# Altium schematic sheet DVT-Discrete-2.SchDoc
size A4
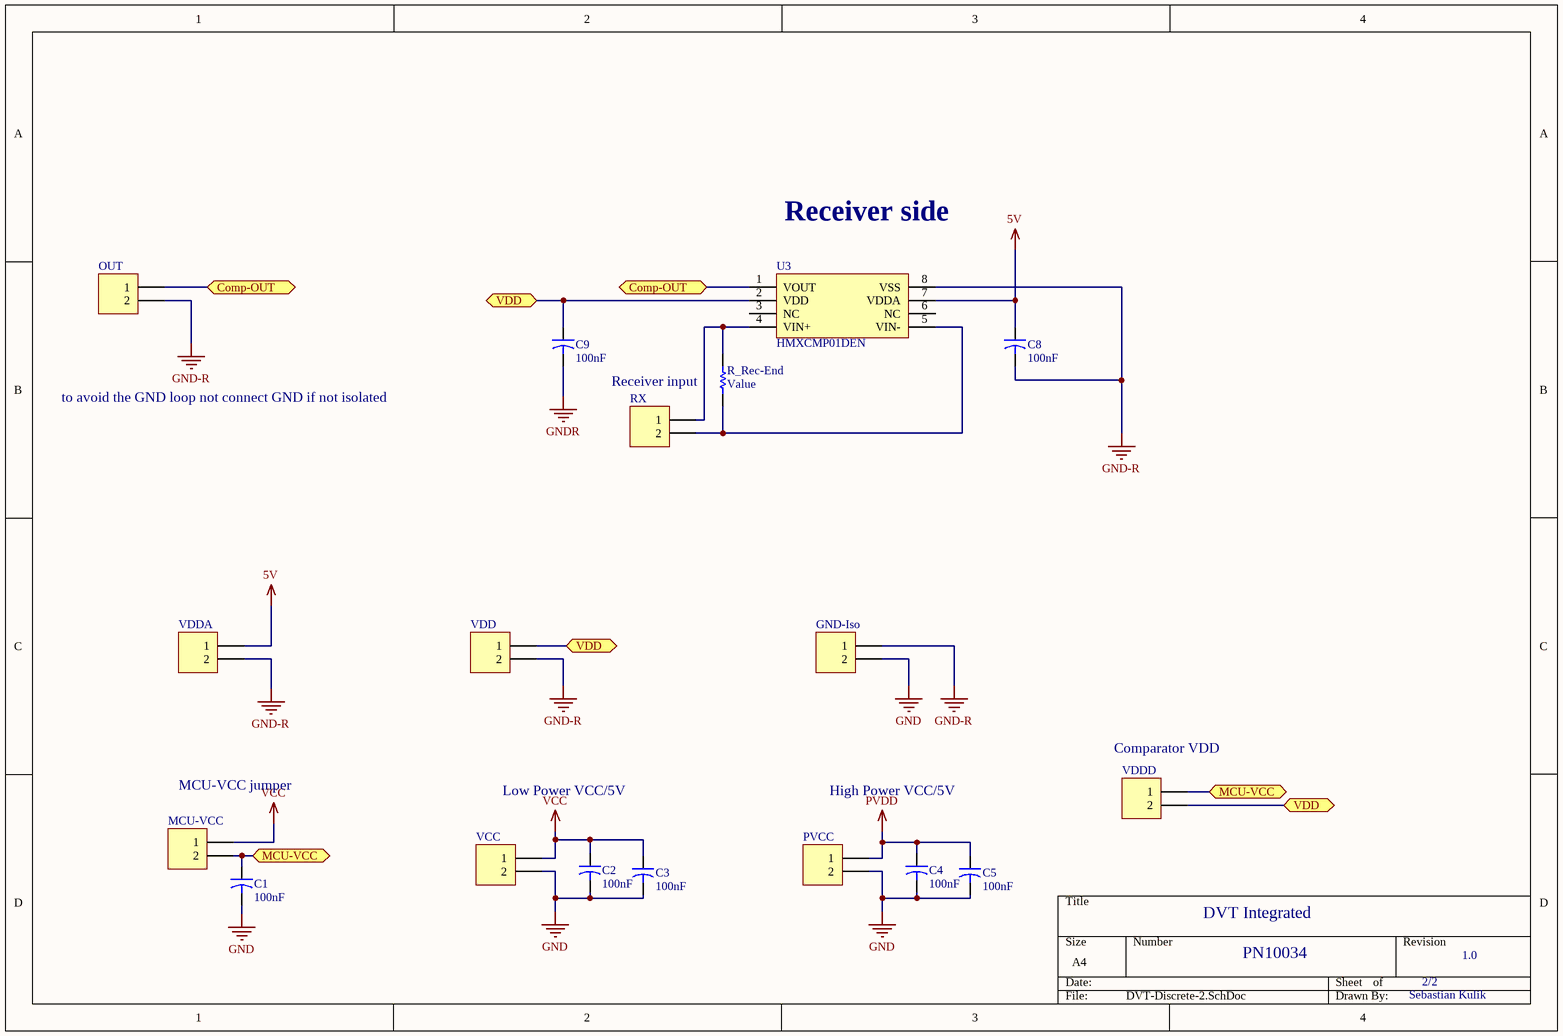
[diagram p0: DVT-Discrete-2.SchDoc]

## Parts
C1  value 100nF  [Dummy-10mm]  (hidden comment: Capacitor-Dummy-THT)
C2  value 100nF  [Dummy-10mm]  (hidden comment: Capacitor-Dummy-THT)
C3  value 100nF  [Dummy-10mm]  (hidden comment: Capacitor-Dummy-THT)
C4  value 100nF  [Dummy-10mm]  (hidden comment: Capacitor-Dummy-THT)
C5  value 100nF  [Dummy-10mm]  (hidden comment: Capacitor-Dummy-THT)
C8  value 100nF  [Dummy-10mm]  (hidden comment: Capacitor-Dummy-THT)
C9  value 100nF  [Dummy-10mm]  (hidden comment: Capacitor-Dummy-THT)
GND-Iso  PHOENIX_1715721  [Phoenix-2-5_08]  (value not drawn)
MCU-VCC  Plug_2_90_2.54  [HDR1X2]  (value not drawn)
OUT  Plug_2_90_2.54  [HDR1X2]  (value not drawn)
PVCC  PHOENIX_1715721  [Phoenix-2-5_08]  (value not drawn)
R_Rec-End  Resistor-Dummy-THT  [Dummy-10mm]  (value not drawn)
RX  PHOENIX_1715721  [Phoenix-2-5_08]  (value not drawn)
U3  HMXCMP01DEN  [Honeywell-SO8]
VCC  PHOENIX_1715721  [Phoenix-2-5_08]  (value not drawn)
VDD  PHOENIX_1715721  [Phoenix-2-5_08]  (value not drawn)
VDDA  PHOENIX_1715721  [Phoenix-2-5_08]  (value not drawn)
VDDD  Plug_2_90_2.54  [HDR1X2]  (value not drawn)

## Ports
Comp-OUT, MCU-VCC, VDD

## Nets
5V: C8.1 U3.7(VDDA) VDDA.1
GND: C1.2 C2.2 C3.2 C4.2 C5.2 GND-Iso.2 PVCC.2 VCC.2
GND-R: C8.2 GND-Iso.1 OUT.2 U3.8(VSS) VDD.2 VDDA.2
GNDR: C9.2
PVDD: C4.1 C5.1 PVCC.1
VCC: C2.1 C3.1 MCU-VCC.1 VCC.1
Comp-OUT: OUT.1 U3.1(VOUT) ; port Comp-OUT
MCU-VCC: C1.1 MCU-VCC.2 VDDD.1 ; port MCU-VCC
VDD: C9.1 U3.2(VDD) VDD.1 VDDD.2 ; port VDD
NetR_Rec-End_1: R_Rec-End.1 RX.2 U3.5(VIN-)
NetR_Rec-End_2: R_Rec-End.2 RX.1 U3.4(VIN+)

Not connected (* = marked no-connect by the designer): U3 3(NC) 6(NC)

## Notes on the sheet
- Receiver side
- to avoid the GND loop not connect GND if not isolated
- (near R_Rec-End) Receiver input
- (near MCU-VCC) MCU-VCC jumper
- (near VDDD) Comparator VDD
- Low Power VCC/5V
- High Power VCC/5V
- DVT Integrated
- PN10034
- 2/2
- 1.0
- Sebastian Kulik

## Library data of the parts
C1-C5 C8 C9 = Capacitor-Dummy-THT: Deliverer PartNr: 699-5027; Manufacturer: AVX; Deliverer: RS; Published: 08.12.2015; Part Description: Capacitor-Dummy-THT; Publisher: Sebastian Kulik; PackageDescription: -; Manufacturer PartNr: -; TDE-PN: -
GND-Iso PVCC RX VCC VDD VDDA = 2Pol_1715721: Phoenix, 2 pol, 5.08mm, 22A, 715721; Deliverer PartNr: 193-0564; Deliverer: RS; TDE-PN: CON0008; LatestRevisionDate: 02.05.2014; LatestRevisionNote: Re-released for DXP Platform.; Publisher: Sebastian Kulik; Manufacturer PartNr: 1715721; Manufacturer: Phoenix; PackageDescription: Phoenix-2-5_08
MCU-VCC OUT VDDD = Plug_2_90_2.54: Plug, 2-Pin; Manufacturer PartNr: 61300211021; Manufacturer: WE; Deliverer PartNr: 2356176; Deliverer: Farnell; TDE-PN: CON0010; LatestRevisionDate: 14.05.2014; LatestRevisionNote: Re-released for DXP Platform.; Publisher: Sebastian Kulik
U3 = HMXCMP01DEN: HiTemp Comparator; Manufacturer: X-Rel; Deliverer: ProTec; TDE-PN: IC0069; Published: 10.12.2015; Deliverer PartNr: HMXCMP01DEN; PackageDescription: Honeywell-SO8; Publisher: Sebastian Kulik; Manufacturer PartNr: HMXCMP01DEN
R_Rec-End = Resistor-Dummy-THT: Published: 08.12.2015; Publisher: Sebastian Kulik; PackageDescription: -; Manufacturer: -; Manufacturer PartNr: -; TDE-PN: -; Deliverer PartNr: -; Deliverer: -; Part Desicription: Resistor-Dummy-THT; Value: Value